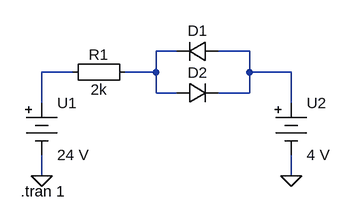
[diagram p0: schematic Draft1.asc]
Draft1.asc, the LTspice schematic file:
Version 4
SHEET 1 880 680
WIRE 64 32 32 32
WIRE 176 32 128 32
WIRE -96 64 -144 64
WIRE 32 64 32 32
WIRE 32 64 -16 64
WIRE 176 64 176 32
WIRE 240 64 176 64
WIRE 32 96 32 64
WIRE 64 96 32 96
WIRE 176 96 176 64
WIRE 176 96 128 96
WIRE -144 112 -144 64
WIRE 240 112 240 64
WIRE -144 224 -144 192
WIRE 240 224 240 192
FLAG -144 224 0
FLAG 240 224 0
SYMBOL diode 128 16 R90
WINDOW 0 0 32 VBottom 2
WINDOW 3 32 32 Invisible 2
SYMATTR InstName D1
SYMBOL diode 64 112 R270
WINDOW 0 32 32 VTop 2
WINDOW 3 0 32 Invisible 2
SYMATTR InstName D2
SYMBOL Misc\\EuropeanResistor 0 48 R90
WINDOW 0 5 56 VBottom 2
WINDOW 3 27 56 VTop 2
SYMATTR InstName R1
SYMATTR Value 2k
SYMBOL Misc\\battery -144 96 R0
SYMATTR InstName U1
SYMATTR Value 24 V
SYMBOL Misc\\battery 240 96 R0
SYMATTR InstName U2
SYMATTR Value 4 V
TEXT -176 248 Left 2 !.tran 1

The netlist it stands for:
* Draft1.asc
D1 N002 N001 D
D2 N001 N002 D
R1 N001 N003 2k
V§U1 N003 0 24 V
V§U2 N002 0 4 V
.model D D
.lib standard.dio
.tran 1
.backanno
.end